# EAGLE design amp-LNA-BFP740Fxxx (EAGLE 9.5.1)
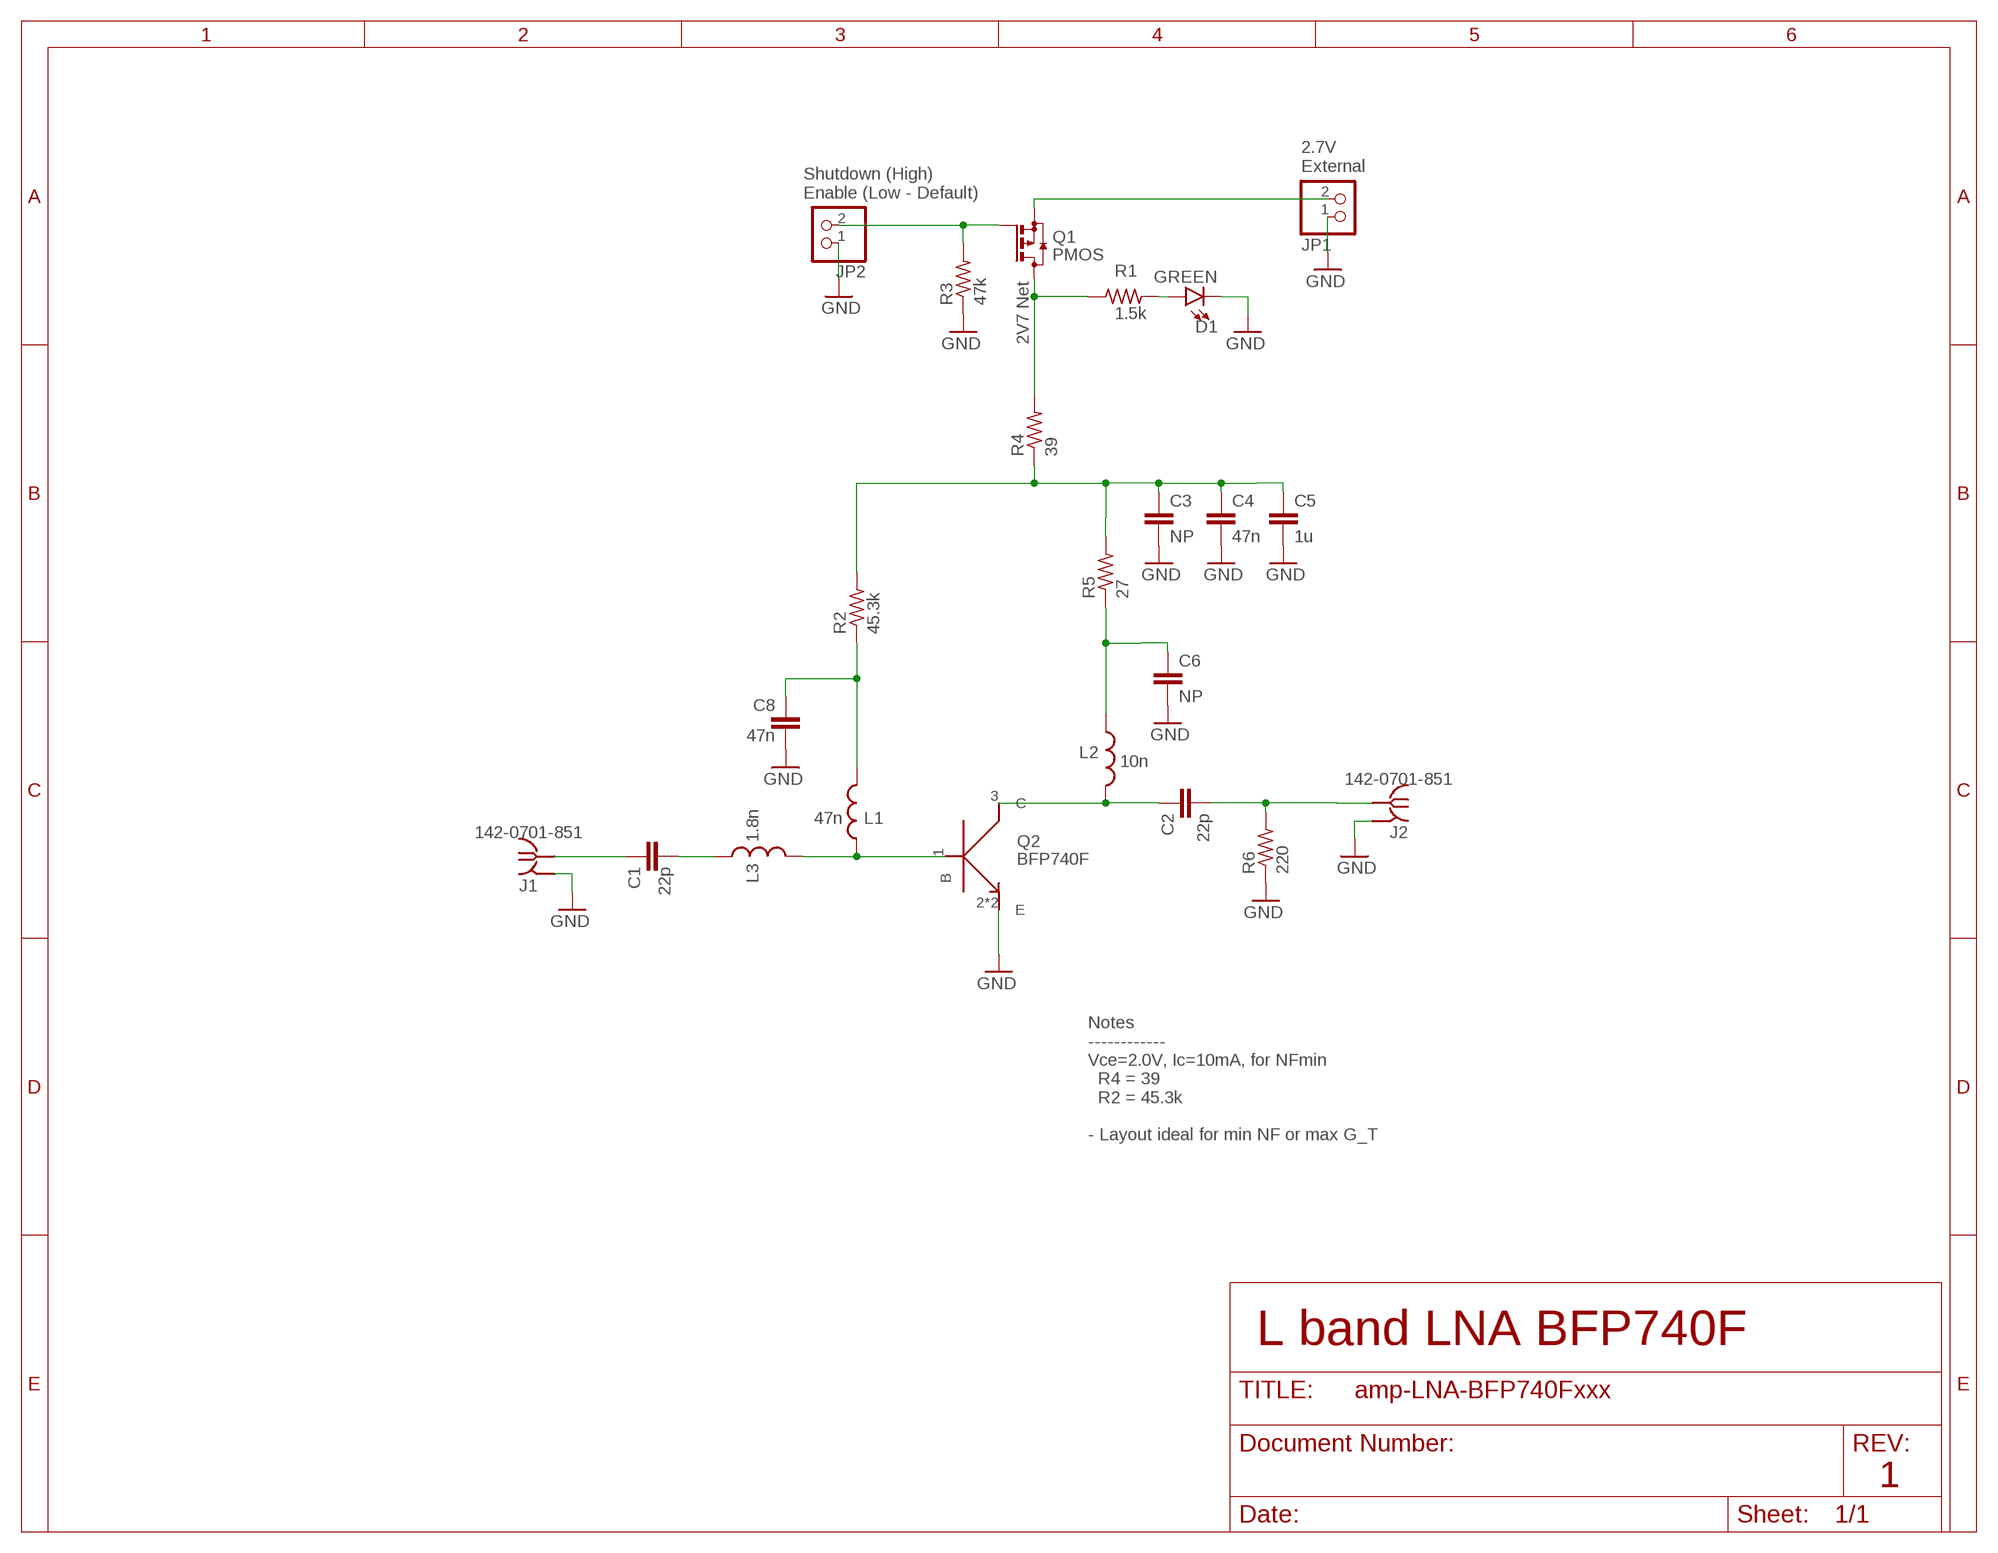
[diagram p0: schematic, sheet 1]

## Parts
C1  22p  C-EU0402-C-NOSILK  [.0402-C-NOSILK]
C2  22p  C-EU0402-C-NOSILK  [.0402-C-NOSILK]
C3  NP  C-EU0603-C-NOSILK  [.0603-C-NOSILK]
C4  47n  C-EU0603-C-NOSILK  [.0603-C-NOSILK]
C5  1u  C-EU0603-C-NOSILK  [.0603-C-NOSILK]
C6  NP  C-EU0402-B-NOSILK  [.0402-B-NOSILK]
C8  47n  C-EU0603-C-NOSILK  [.0603-C-NOSILK]
D1  GREEN  LED-GREEN0603  [LED-0603]
J1  142-0701-851  [142-0701-851]
J2  142-0701-851  [142-0701-851]
JP1  PINHD-1X2  [1X02]
JP2  PINHD-1X2  [1X02]
L1  47n  L-US0603-C-NOSILK  [.0603-C-NOSILK]
L2  10n  L-US0603-C-NOSILK  [.0603-C-NOSILK]
L3  1.8n  L-US0402-C-NOSILK  [.0402-C-NOSILK]
Q1  PMOS  BSS84  [SOT23]
Q2  BFP740F  BFPXXXF  [TSFP4]
R1  1.5k  R-US_0603-C-NOSILK  [.0603-C-NOSILK]
R2  45.3k  R-US_0603-C-NOSILK  [.0603-C-NOSILK]
R3  47k  R-US_0402-B-NOSILK  [.0402-B-NOSILK]
R4  39  R-US_0603-C-NOSILK  [.0603-C-NOSILK]
R5  27  R-US_0603-C-NOSILK  [.0603-C-NOSILK]
R6  220  R-US_0603-C-NOSILK  [.0603-C-NOSILK]

## Nets
2V7: Q1.3(D) R1.1 R4.2
B [RF2]: L1.1 L3.2 Q2.1(B)
C [RF2]: C2.1 L2.2 Q2.3(C)
CAPS: C3.1 C4.1 C5.1 R2.2 R4.1 R5.2
GND: C3.2 C4.2 C5.2 C6.2 C8.2 D1.C J1.GND1(GND) J1.GND2(GND) J1.GND3(GND) J1.GND4(GND) J2.GND1(GND) J2.GND2(GND) J2.GND3(GND) J2.GND4(GND) JP1.1 JP2.1 Q2.2(E) Q2.4(E) R3.1 R6.1
N$1: JP2.2 Q1.1(G) R3.2
N$2 [RF2]: C1.2 L3.1
N$3: C6.1 L2.1 R5.1
N$7: C8.1 L1.2 R2.1
N$10: D1.A R1.2
RF_IN [RF2]: C1.1 J1.RF1(RF)
RF_OUT [RF2]: C2.2 J2.RF1(RF) R6.2
VEXT: JP1.2 Q1.2(S)

## Notes on the sheet
- 2.7V
  External
- Shutdown (High)
  Enable (Low - Default)
- 2V7 Net
- Notes
  ------------
  Vce=2.0V, Ic=10mA, for NFmin
    R4 = 39
    R2 = 45.3k
  
  - Layout ideal for min NF or max G_T
- L band LNA BFP740F
- 1

## Library data of the parts
C1-C6 C8 = oresat-rcl:C-EU: CAPACITOR, European symbol
D1 = SparkFun-LED:LED-GREEN: Green SMD LED Used in manufacturing of various products at SparkFun Packages: 0603 - SMD 0603 package [Product Link] <http://www.futureelectronics.com/en/technologies/semiconductors/optoelectronics/leds/Pages/9894312-LTST-C190GKT.aspx?CrossPart=HSMG-C190&IM=0> LilyPad 1206 - SMD1206 LilyPad package [Product Link] <http://www.futureelectronics.com/en/Technologies/Product.aspx?ProductID=IN150NGHARVATEKCORPORATION2049943&IM=0> 1206 - SMD1206 package [Product Link] <http://www.futureelectronics.com/en/technologies/semiconductors/optoelectronics/leds/Pages/8315665-LTST-C150KGKT.aspx?IM=0> 1206 Bottom Mount -SMD 1206 Bottom Mount [Product Link] <http://www.digikey.com/product-detail/en/lite-on-inc/LTST-C230KGKT/160-1456-1-ND/386854> SparkFun Products: Pro Mini 328 -5V <https://www.sparkfun.com/products/821> RedBoard <https://www.sparkfun.com/products/12757> MP3 Trigger <https://www.sparkfun.com/products/13720> Makey Makey <https://www.sparkfun.com/products/11076>
J1 J2 = J-Cinch-142-0701-851-SMA-end-launch:142-0701-851: SMA Jack 50Ω - End Launch Source: Datasheet <https://belfuse.com/resources/productinformations/cinchconnectivitysolutions/johnson/pi-ccs-john-142-0701-851.pdf>
JP1 JP2 = pinhead:PINHD-1X2: PIN HEADER
L1-L3 = oresat-rcl:L-US: INDUCTOR, American symbol
Q1 = transistor-small-signal:BSS84: P-CHANNEL MOS FET
Q2 = Q-Infineon-BFPXXX-RF-BJT:BFPXXXF: Infineon NPN RF Bipolar Transistor Family TSFP4 package Source: RF Transistors <https://www.infineon.com/cms/en/product/rf-wireless-control/rf-transistor/>
R1-R6 = oresat-rcl:R-US_: RESISTOR, American symbol

## Net classes
1 RF1: clearance 0.5 mm
2 RF2: clearance 0.8 mm

## Board
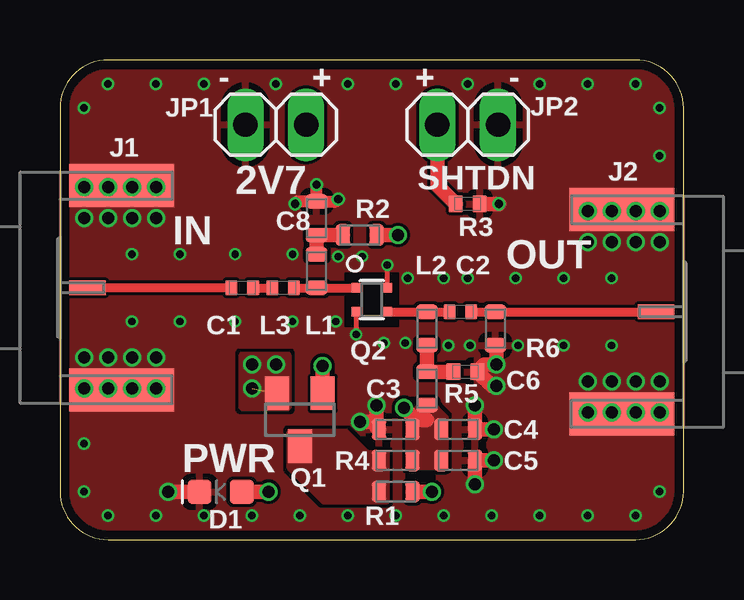
[diagram p1: board, top side]
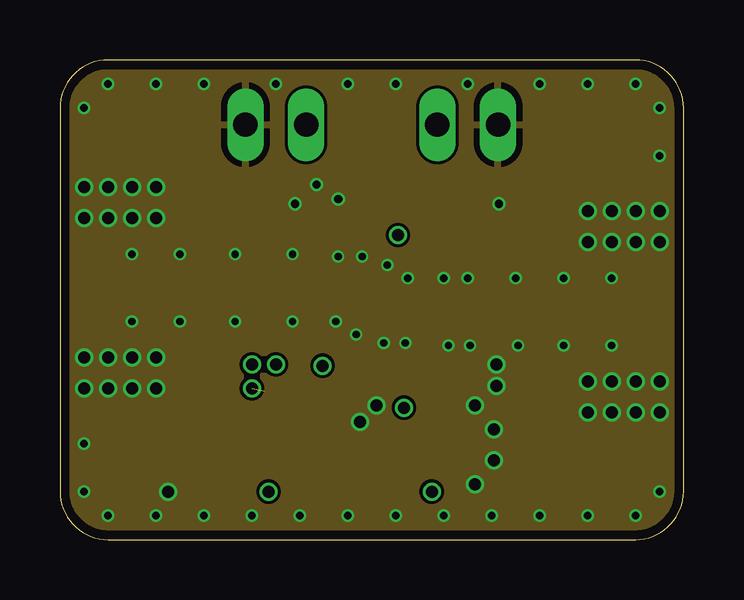
[diagram p2: board, inner layer Route2]
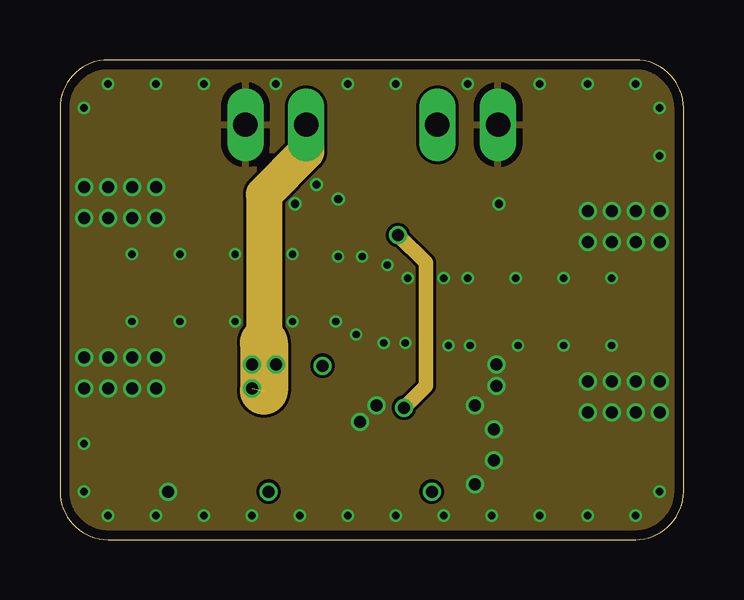
[diagram p3: board, inner layer Route15]
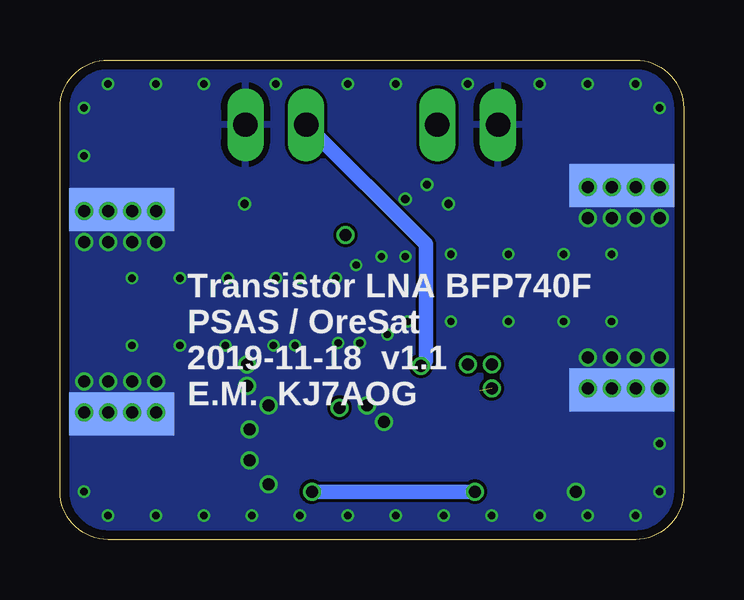
[diagram p4: board, bottom side, seen from below]

Size 26 x 20 mm. Coordinates in mm from the lower left corner, seen from the top.
Outline: 0,18 0,2 arc90 2,0 24,0 arc90 26,2 26,18 arc90 24,20 2,20 arc90 0,18
Copper layers (1*2*15*16): Top 0.035559375mm / dielectric 0.17018125mm / Route2 0.01778125mm / dielectric 47mil / Route15 0.01778125mm / dielectric 0.17018125mm / Bottom 0.035559375mm
Design rules "oshpark-4layer-tented": minimum track width 5mil, minimum drill 10mil, track to track 5mil, track to pad 5mil, pad to pad 5mil, via to via 5mil, smd to smd 5mil, copper to edge 15mil, drill to drill 6mil, minimum pad ring 4mil, minimum via ring 4mil, stop-mask expansion 2.5mil, vias tented up to drill 20mil, thermal gap 10mil

### Footprints (pad centres in the part's own frame; a part is rotated, then mirrored left to right if it is on the bottom)
.0402-C-NOSILK = smd 0.5 x 0.6: 1 -0.45,0; 2 0.45,0
.0603-C-NOSILK = smd 0.6 x 0.9: 1 -0.7,0; 2 0.7,0
.0402-B-NOSILK = smd 0.6 x 0.7: 1 -0.5,0; 2 0.5,0
LED-0603 = smd 1 x 1: A -0.877,0; C 0.877,0
142-0701-851 = smd 1.8 x 4.37: GND1 -4.255,-2.566; GND2 4.255,-2.566 | smd 1.8 x 4.37 bottom: GND3 -4.255,-2.566; GND4 4.255,-2.566 | smd 0.6 x 1.53: RF1 0,-1.146
1X02 = drill 1.016 long: 1 -1.27,0; 2 1.27,0
SOT23 = smd 1 x 1.4: 1 -0.95,-1.1; 2 0.95,-1.1; 3 0,1.1
TSFP4 = smd 0.4 x 0.4: 1 -0.5,-0.65; 2 0.5,-0.65; 3 0.5,0.65; 4 -0.5,0.65

### Placement (x,y rotation side)
C1  7.6,10.5 0 top
C2  16.7,9.5 0 top
C3  14,4.6 180 top
C4  16.6,4.6 0 top
C5  16.6,3.3 0 top
C6  16.9,7 0 top
C8  10.7,13.4 90 top
D1  6.7,1.99 180 top
J1  0,10.5 90 top
J2  26,9.5 270 top
JP1  9,17.3 0 top
JP2  17,17.3 180 top
L1  10.7,11.2 90 top
L2  15.3,8.8 90 top
L3  9.3,10.5 0 top
Q1  10,5 180 top
Q2  13,10 270 top
R1  14,2 0 top
R2  12.5,12.7 0 top
R3  17,14 180 top
R4  14,3.3 180 top
R5  15.3,6.3 270 top
R6  18.15,8.8 90 top

### Tracks (layer width: path | path; a pad name or v marks a point on that pad's centre or on a via)
2V7
  pour Top (no thermals): 9.6,4.5 11.9,4.5 12.8,3.6 13.6,3.6 13.6,1.6 11,1.6 9.6,3
B
  Top 0.38: L3.2 L1.1 Q2.1
C
  Top 0.38: Q2.3 L2.2 C2.1
CAPS  (via drill 0.5)
  Top 0.6: R2.2 v14.1,12.7 | v14.35,5.5 14.85,5 15.3,5
  Route15 0.6: v14.1,12.7 15.25,11.55 15.25,6.4 v14.35,5.5
  pour Top (no thermals): 15.3,5.8 15.4,5.8 16.1,5.1 16.1,3 14.5,3 14.5,5.1 15.2,5.8
GND  (via drill 0.3, 0.35, 0.5)
  Top 0.2: Q2.4 v13.65,11.45 | Q2.2 v12.35,8.55
  Top 0.5: C8.2 11.5,14.1 v11.6,14.2 | C8.2 v10.7,14.8 | C8.2 9.9,14.1 v9.8,14
  Top 0.6: v4.5,2 v4.51,1.99 D1.C | v18.1,3.3 C5.2 v17.3,2.3 | v18.1,4.6 C4.2 v17.3,5.6 | v18.2,6.4 18,6.4 C6.2 17.7,7.3 v18.2,7.3 18.2,8.05 R6.1 | v13.2,5.6 13.2,4.7 C3.2 13,4.9 v12.5,4.9 | R3.1 v18.3,14
  other vias: 1,14.7 2,14.7 3,14.7 4,14.7 1,13.4 2,13.4 3,13.4 4,13.4 1,6.3 2,6.3 3,6.3 4,6.3 1,7.6 2,7.6 3,7.6 4,7.6 22,13.7 23,13.7 24,13.7 25,13.7 22,12.4 23,12.4 24,12.4 25,12.4 25,5.3 24,5.3 23,5.3 22,5.3 22,6.6 23,6.6 24,6.6 25,6.6 3,11.9 5,11.9 7.3,11.9 9.7,11.9 3,9.1 5,9.1 7.3,9.1 9.7,9.1 11.5,9.1 11.6,11.8 12.6,11.8 14.4,8.2 13.5,8.2 23,10.9 21,10.9 19,10.9 17,10.9 16,10.9 14.5,10.9 16.2,8.1 17.1,8.1 23,8.1 21,8.1 19.1,8.1 1,2 1,4 2,1 4,1 6,1 8,1 10,1 12,1 14,1 16,1 18,1 20,1 22,1 24,1 25,2 25,18 25,16 24,19 22,19 20,19 17,19 14,19 12,19 9,19 2,19 4,19 6,19 1,18
  pour Top (rank 2): 0,20 26,20 26,0 0,0
  pour Bottom: 0,20 26,20 26,0 0,0
  pour Route2: 0,20 26,20 26,0 0,0
  pour Route15: 0,20 26,20 26,0 0,0
  pour Top (no thermals): 0,16 5,16 5,5 0,5
  pour Top (no thermals): 21,15 26,15 26,4 21,4
  pour Bottom (no thermals): 21,15 26,15 26,4 21,4
  pour Bottom (no thermals): 0,16 5,16 5,5 0,5
  cutout Top (no thermals): 11.9,11.1 14.1,11.1 14.1,8.9 11.9,8.9
N$1  (via drill 0.5)
  Top 0.6: Q1.1 v10.95,7.25 | R3.2 15.73,14.77 JP2.2
  Bottom 0.6: v10.95,7.25 10.75,7.45 10.75,12.32 JP2.2
N$2
  Top 0.38: C1.2 L3.1
N$3
  Top 0.6: C6.1 R5.1 L2.1
N$7
  Top 0.6: L1.2 C8.1 R2.1
N$10  (via drill 0.5)
  Top 0.6: D1.A v8.69,1.99 v8.7,2 | v15.5,2 R1.2
  Bottom 0.6: v8.7,2 v15.5,2
RF_IN
  Top 0.38: C1.1 J1.RF1
  pour Top: 1.7,10.7 1.9,10.7 2.1,10.5 1.9,10.3 1.7,10.3
RF_OUT
  Top 0.38: C2.2 R6.2 J2.RF1
  pour Top: 24.3,9.7 24.1,9.7 23.9,9.5 24.1,9.3 24.3,9.3
VEXT  (via drill 0.5)  (1 unrouted)
  Route15 1.5: JP1.2 10.27,16.17 8.5,14.4 8.5,8.2
  Route15 2: 8.5,8.2 8.5,6.2
  other vias: 9,7.3 8,7.3 8,6.3
  pour Top (no thermals): 7.6,7.7 9.5,7.7 9.5,5.5 7.6,5.5

### Text on the board
tPlace: - | + | + | - | SHTDN | 2V7 | IN | OUT | PWR
bPlace: Transistor LNA BFP740F / PSAS / OreSat / 2019-11-18 v1.1 / E.M. KJ7AOG